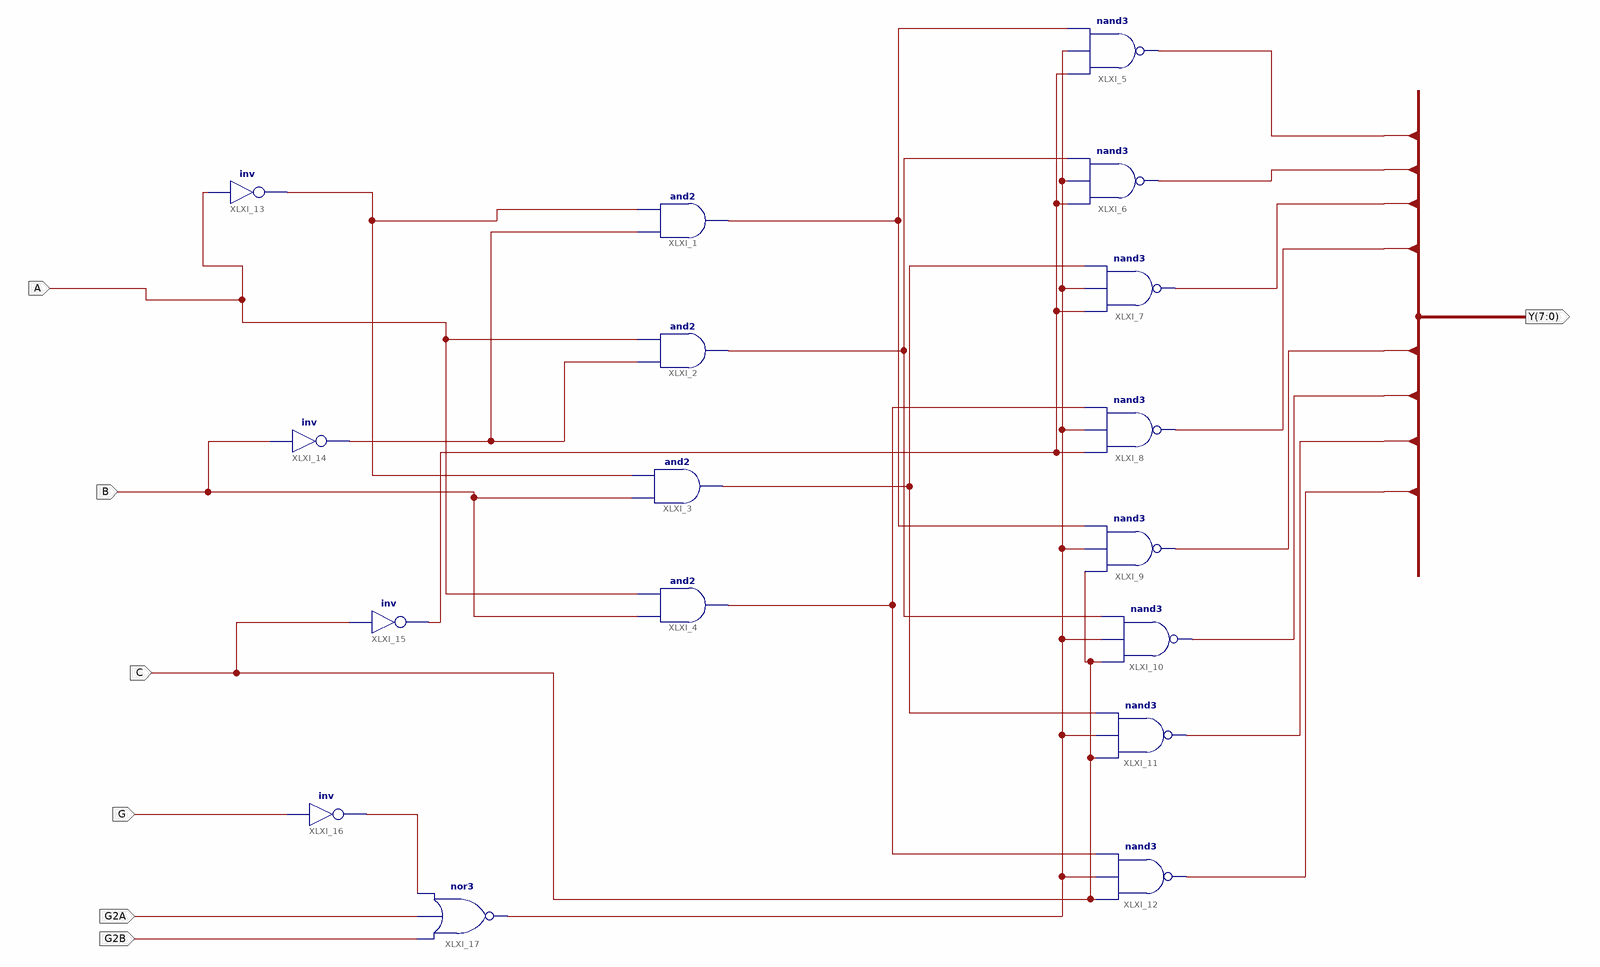
[diagram p0: schematic sheet 1]
// Xilinx ISE schematic D_74LS138.sch (kintex7) as structural Verilog: 17 symbols, 7 ports
module D_74LS138 (
  input  A,
  input  B,
  input  C,
  input  G2A,
  input  G2B,
  input  G,
  output [7:0] Y
);

  wire XLXN_2, XLXN_8, XLXN_13, XLXN_20, XLXN_22, XLXN_24, XLXN_26, XLXN_34, XLXN_39;

  and XLXI_1 (XLXN_20, XLXN_8, XLXN_2);
  and XLXI_2 (XLXN_22, XLXN_8, A);
  and XLXI_3 (XLXN_24, B, XLXN_2);
  and XLXI_4 (XLXN_26, B, A);
  nand XLXI_5 (Y[0], XLXN_34, XLXN_13, XLXN_20);
  nand XLXI_6 (Y[1], XLXN_34, XLXN_13, XLXN_22);
  nand XLXI_7 (Y[2], XLXN_34, XLXN_13, XLXN_24);
  nand XLXI_8 (Y[3], XLXN_34, XLXN_13, XLXN_26);
  nand XLXI_9 (Y[4], C, XLXN_13, XLXN_20);
  nand XLXI_10 (Y[5], C, XLXN_13, XLXN_22);
  nand XLXI_11 (Y[6], C, XLXN_13, XLXN_24);
  nand XLXI_12 (Y[7], C, XLXN_13, XLXN_26);
  not XLXI_13 (XLXN_2, A);
  not XLXI_14 (XLXN_8, B);
  not XLXI_15 (XLXN_34, C);
  not XLXI_16 (XLXN_39, G);
  nor XLXI_17 (XLXN_13, G2B, G2A, XLXN_39);
endmodule
